# EAGLE design Maker Faire Machine Panel3 (EAGLE 7.5.0)
DATABASE: /home/monkbroc/Electronics/eagle/PARTSDB.tsv
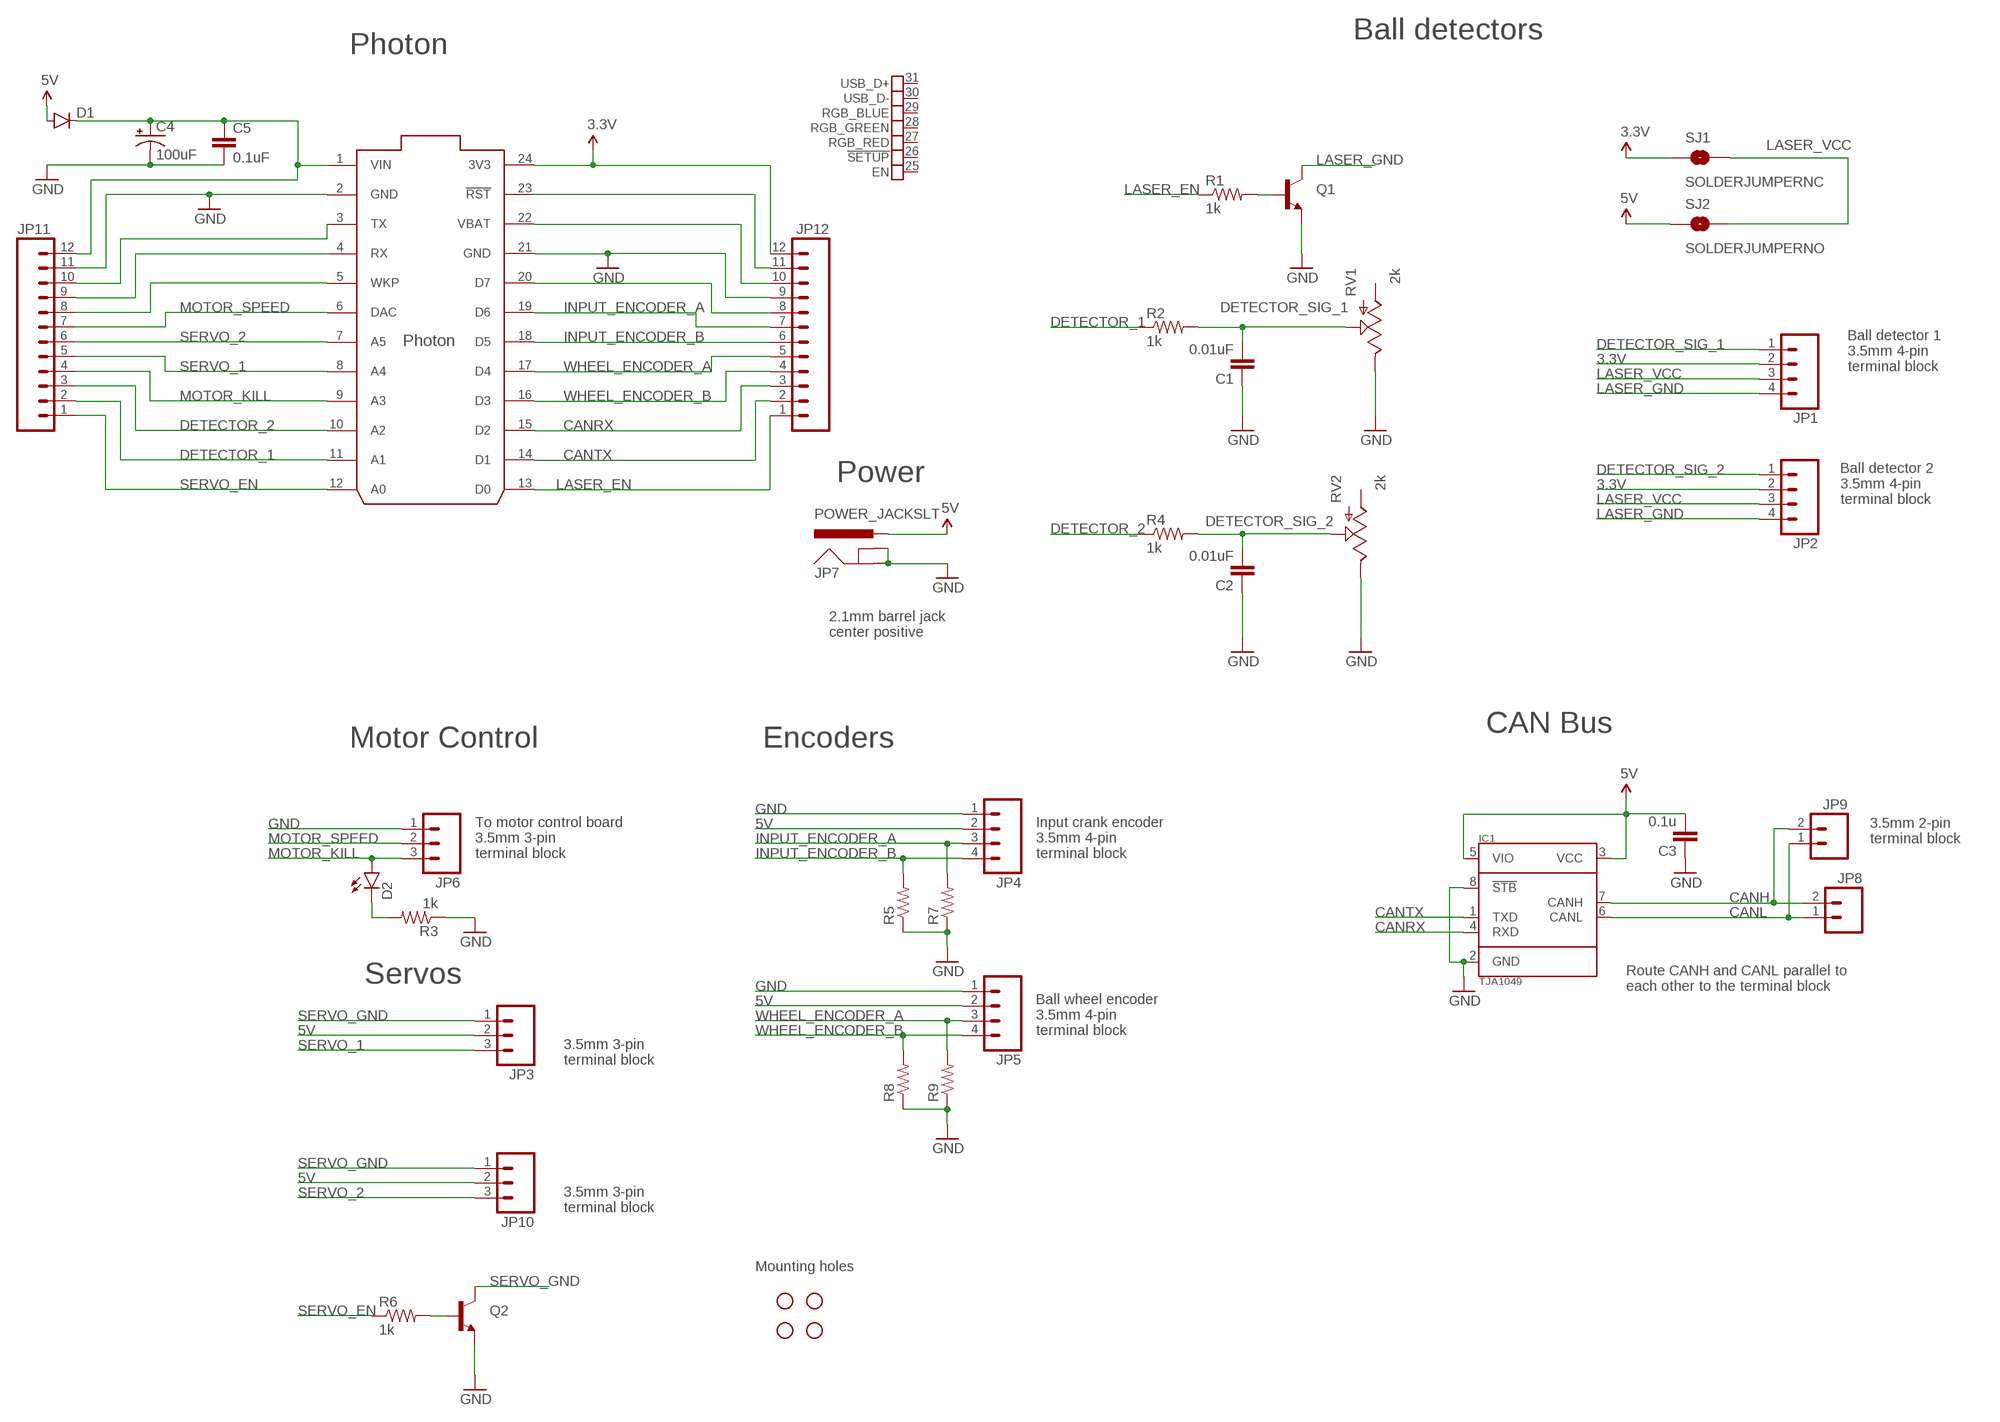
[diagram p0: schematic, sheet 1]

## Parts
C1  0.01uF  CAP1206  [1206]
C2  0.01uF  CAP1206  [1206]
C3  0.1u  CAP1206  [1206]
C4  100uF  CAP_POLPTH1  [CPOL-RADIAL-100UF-25V]
C5  0.1uF  CAP1206  [1206]
D1  DIODESMA  [SMA-DIODE]
D2  LED5MM  [LED5MM]
IC1  TJA1049  [SO8]
JP1  M04SCREW  [SCREWTERMINAL-3.5MM-4]
JP2  M04SCREW  [SCREWTERMINAL-3.5MM-4]
JP3  M03SCREW  [SCREWTERMINAL-3.5MM-3]
JP4  M04SCREW  [SCREWTERMINAL-3.5MM-4]
JP5  M04SCREW  [SCREWTERMINAL-3.5MM-4]
JP6  M03SCREW  [SCREWTERMINAL-3.5MM-3]
JP7  POWER_JACKSLT  [POWER_JACK_SLOT]
JP8  M023.5MM  [SCREWTERMINAL-3.5MM-2]
JP9  M023.5MM  [SCREWTERMINAL-3.5MM-2]
JP10  M03SCREW  [SCREWTERMINAL-3.5MM-3]
JP11  M12NO_SILK  [1X12_NO_SILK]
JP12  M12NO_SILK  [1X12_NO_SILK]
Q1  TRANSISTOR_NPNTO-92-AMMO  [TO-92-AMMO]
Q2  TRANSISTOR_NPNTO-92-AMMO  [TO-92-AMMO]
R1  1k  RESISTOR1206  [1206]
R2  1k  RESISTOR1206  [1206]
R3  1k  RESISTOR1206  [1206]
R4  1k  RESISTOR1206  [1206]
R5  RESISTORKIT  [AXIAL-0.3-KIT]
R6  1k  RESISTOR1206  [1206]
R7  RESISTORKIT  [AXIAL-0.3-KIT]
R8  RESISTORKIT  [AXIAL-0.3-KIT]
R9  RESISTORKIT  [AXIAL-0.3-KIT]
RV1  2k  POT100K_3362U  [3362U]
RV2  2k  POT100K_3362U  [3362U]
SJ1  SOLDERJUMPERNC  [SJ_2S]
SJ2  SOLDERJUMPERNO  [SJ_2S-NO]
STANDOFF1  STAND-OFF  [STAND-OFF]
STANDOFF2  STAND-OFF  [STAND-OFF]
STANDOFF3  STAND-OFF  [STAND-OFF]
STANDOFF4  STAND-OFF  [STAND-OFF]
U$1  PHOTON_SMD  [PHOTON_SMD]

## Nets
3.3V: JP1.2 JP2.2 JP12.12 SJ1.1 U$1.24(3V3)
5V: C3.2 D1.A IC1.3(VCC) IC1.5(VIO) JP3.2 JP4.2 JP5.2 JP7.PWR JP10.2 SJ2.1
CANH: IC1.7(CANH) JP8.2 JP9.2
CANL: IC1.6(CANL) JP8.1 JP9.1
CANRX: IC1.4(RXD) JP12.3 U$1.15(D2)
CANTX: IC1.1(TXD) JP12.2 U$1.14(D1)
DETECTOR_1: JP11.2 R2.1 U$1.11(A1)
DETECTOR_2: JP11.3 R4.1 U$1.10(A2)
DETECTOR_SIG_1: C1.2 JP1.1 R2.2 RV1.P$2(S)
DETECTOR_SIG_2: C2.2 JP2.1 R4.2 RV2.P$2(S)
GND: C1.1 C2.1 C3.1 C4.2(-) C5.2 IC1.2(GND) IC1.8(!STB) JP4.1 JP5.1 JP6.1 JP7.GND@1(GNDBREAK) JP7.GND@2(GND) JP11.11 JP12.9 Q1.1(E) Q2.1(E) R3.1 R5.P$1 R7.P$1 R8.P$1 R9.P$1 RV1.P$1(E) RV2.P$1(E) U$1.2(GND) U$1.21(GND)
INPUT_ENCODER_A: JP4.3 JP12.7 R7.P$2 U$1.19(D6)
INPUT_ENCODER_B: JP4.4 JP12.6 R5.P$2 U$1.18(D5)
LASER_EN: JP12.1 R1.1 U$1.13(D0)
LASER_GND: JP1.4 JP2.4 Q1.3(C)
LASER_VCC: JP1.3 JP2.3 SJ1.2 SJ2.2
MOTOR_KILL: D2.A JP6.3 JP11.4 U$1.9(A3)
MOTOR_SPEED: JP6.2 JP11.7 U$1.6(DAC)
N$1: Q1.2(B) R1.2
N$4: Q2.2(B) R6.2
N$5: D2.K(C) R3.2
N$11: JP12.8 U$1.20(D7)
N$13: JP12.10 U$1.22(VBAT)
N$14: JP12.11 U$1.23(!RST)
RX: JP11.9 U$1.4(RX)
SERVO_1: JP3.3 JP11.5 U$1.8(A4)
SERVO_2: JP10.3 JP11.6 U$1.7(A5)
SERVO_EN: JP11.1 R6.1 U$1.12(A0)
SERVO_GND: JP3.1 JP10.1 Q2.3(C)
TX: JP11.10 U$1.3(TX)
VIN: C4.1(+) C5.1 D1.C JP11.12 U$1.1(VIN)
WHEEL_ENCODER_A: JP5.3 JP12.5 R9.P$2 U$1.17(D4)
WHEEL_ENCODER_B: JP5.4 JP12.4 R8.P$2 U$1.16(D3)
WKP: JP11.8 U$1.5(WKP)
Unconnected: RV1.P$3(A) RV2.P$3(A) U$1.25(EN) U$1.26(!SETUP) U$1.27(RGB_RED) U$1.28(RGB_GREEN) U$1.29(RGB_BLUE) U$1.30(USB_D-) U$1.31(USB_D+)

## Notes on the sheet
- Ball detectors
- Photon
- Ball detector 1
  3.5mm 4-pin
  terminal block
- Power
- Ball detector 2
  3.5mm 4-pin
  terminal block
- 2.1mm barrel jack
  center positive
- CAN Bus
- Motor Control | Encoders
- 3.5mm 2-pin
  terminal block
- To motor control board
  3.5mm 3-pin
  terminal block
- Input crank encoder
  3.5mm 4-pin
  terminal block
- Servos
- Route CANH and CANL parallel to
  each other to the terminal block
- Ball wheel encoder
  3.5mm 4-pin
  terminal block
- 3.5mm 3-pin
  terminal block
- 3.5mm 3-pin
  terminal block
- Mounting holes

## Library data of the parts
C1 C2 = SparkFun-Passives:CAP: Capacitor Standard 0603 ceramic capacitor, and 0.1" leaded capacitor.; PARTNO: 12065C103KAT2A
C3 C5 = SparkFun-Capacitors:CAP: Capacitor Standard 0603 ceramic capacitor, and 0.1" leaded capacitor.; PARTNO: 12065C104KAT2A
C4 = SparkFun-Capacitors:CAP_POL: Capacitor Polarized These are standard SMD and PTH capacitors. Normally 10uF, 47uF, and 100uF in electrolytic and tantalum varieties. Always verify the external diameter of the through hole cap, it varies with capacity, voltage, and manufacturer. The EIA devices should be standard.; PARTNO: EEU-FM1H101B
D1 = SparkFun-DiscreteSemi:DIODE: Diode These are standard reverse protection diodes and small signal diodes. SMA package can handle up to about 1A. SOD-323 can handle about 200mA. What the SOD-323 package when ordering, there are some mfgs out there that are 5-pin packages.; PARTNO: B230A-13-F
D2 = SparkFun-LED:LED: LEDs Standard schematic elements and footprints for 5mm, 3mm, 1206, and 0603 sized LEDs. 5mm - Spark Fun Electronics SKU : COM-00529 (and others); PARTNO: SSL-LX5093HD
IC1 = CAN:TJA1049; PARTNO: TJA1049T-118
JP1 JP2 JP4 = SparkFun-Connectors:M04: Header 4 Standard 4-pin 0.1" header. Use with straight break away headers (SKU : PRT-00116), right angle break away headers (PRT-00553), swiss pins (PRT-00743), machine pins (PRT-00117), and female headers (PRT-00115). Molex polarized connector foot print use with SKU : PRT-08231 with associated crimp pins and housings. 1MM SMD Version SKU: PRT-10208; PARTNO: OSTTE040104
JP3 JP6 = SparkFun-Connectors:M03: Header 3 Standard 3-pin 0.1" header. Use with straight break away headers (SKU : PRT-00116), right angle break away headers (PRT-00553), swiss pins (PRT-00743), machine pins (PRT-00117), and female headers (PRT-00115). Molex polarized connector foot print use with SKU : PRT-08232 with associated crimp pins and housings.; PARTNO: OSTTE020104; PROD_ID: CONN-08288
JP5 = SparkFun-Connectors:M04: Header 4 Standard 4-pin 0.1" header. Use with straight break away headers (SKU : PRT-00116), right angle break away headers (PRT-00553), swiss pins (PRT-00743), machine pins (PRT-00117), and female headers (PRT-00115). Molex polarized connector foot print use with SKU : PRT-08231 with associated crimp pins and housings. 1MM SMD Version SKU: PRT-10208; PARTNO: OSTTE030104
JP7 = SparkFun-Connectors:POWER_JACK: Power Jack This is the standard 5.5mm barrel jack for power. The PTH is the most common, proven, reliable, footprint. The Slot footprint only works if the mill layer is transmitted to the PCB fab house so be warned. Mating wall wart : TOL-00298 (and others); PARTNO: PJ-202A; PROD_ID: PRT-00119
JP8 JP9 = SparkFun-Connectors:M02: Standard 2-pin 0.1" header. Use with - straight break away headers ( PRT-00116) - right angle break away headers (PRT-00553) - swiss pins (PRT-00743) - machine pins (PRT-00117) - female headers (PRT-00115) Molex polarized connector foot print use with: PRT-08233 with associated crimp pins and housings. 2.54_SCREWTERM for use with PRT-10571. 3.5mm Screw Terminal footprints for PRT-08084 5mm Screw Terminal footprints for use with PRT-08432; PARTNO: OSTTE020104; PROD_ID: CONN-08399
JP10 = SparkFun-Connectors:M03: Header 3 Standard 3-pin 0.1" header. Use with straight break away headers (SKU : PRT-00116), right angle break away headers (PRT-00553), swiss pins (PRT-00743), machine pins (PRT-00117), and female headers (PRT-00115). Molex polarized connector foot print use with SKU : PRT-08232 with associated crimp pins and housings.; PARTNO: OSTTE030104; PROD_ID: CONN-08288
JP11 JP12 = SparkFun-Connectors:M12: Header 12 Standard 12-pin 0.1" header. Use with straight break away headers (SKU : PRT-00116), right angle break away headers (PRT-00553), swiss pins (PRT-00743), machine pins (PRT-00117), and female headers (PRT-00115).; BOM: EXCLUDE
Q1 Q2 = SparkFun-DiscreteSemi:TRANSISTOR_NPN: Generic NPN BJT MMBT2222A - TRANS-08049 (SOT-23, 1A 40V) MPSA42 - TRANS-09116 (SOT-23, 500mA 300V) MMBT5088LT1G - TRANS-11160 (SOT-23, 50 mA 30V) BC547 - COM-08928 <http://www.sparkfun.com/products/8928> (TO-92 45V 100mA) (1.Collector 2.Base 3.Emitter) 2N3904 - COM-00521 <http://www.sparkfun.com/products/521> (TO-92 40V 200mA) (1.Emitter 2.Base 3.Collector) P2N2222A - COM-12852 <http://www.sparkfun.com/products/12852> (TO-92 40V 600mA) (1.Collector 2.Base 3.Emitter); PARTNO: PN2222ABU
R1-R4 R6 = SparkFun-Passives:RESISTOR: Resistor Basic schematic elements and footprints for 0603, 1206, and PTH resistors.; PARTNO: ERJ-8ENF1001V
R5 R7-R9 = SparkFun-Resistors:RESISTOR: Resistor Basic schematic elements and footprints for 0603, 1206, and PTH resistors.; BOM: EXCLUDE
RV1 RV2 = SparkFun-Electromechanical:POT; PARTNO: 3362U-1-202LF
SJ1 SJ2 = SparkFun-Retired:SOLDERJUMPER: Solder Jumper Standard SMD solder jumper. Used to automate production. Two varients : Normally Open and Normally Closed are the same, but have different paste layers. NC will have a large amount of paste and should jumper during reflow.; BOM: EXCLUDE
STANDOFF1-STANDOFF4 = SparkFun-Electromechanical:STAND-OFF: #4 Stand Off This is the mechanical footprint for a #4 phillips button head screw. Use the keepout ring to avoid running the screw head into surrounding components. SKU : PRT-00447; BOM: EXCLUDE
U$1 = Particle-Devices:PHOTON_SMD: Particle Photon surface mount

## Board
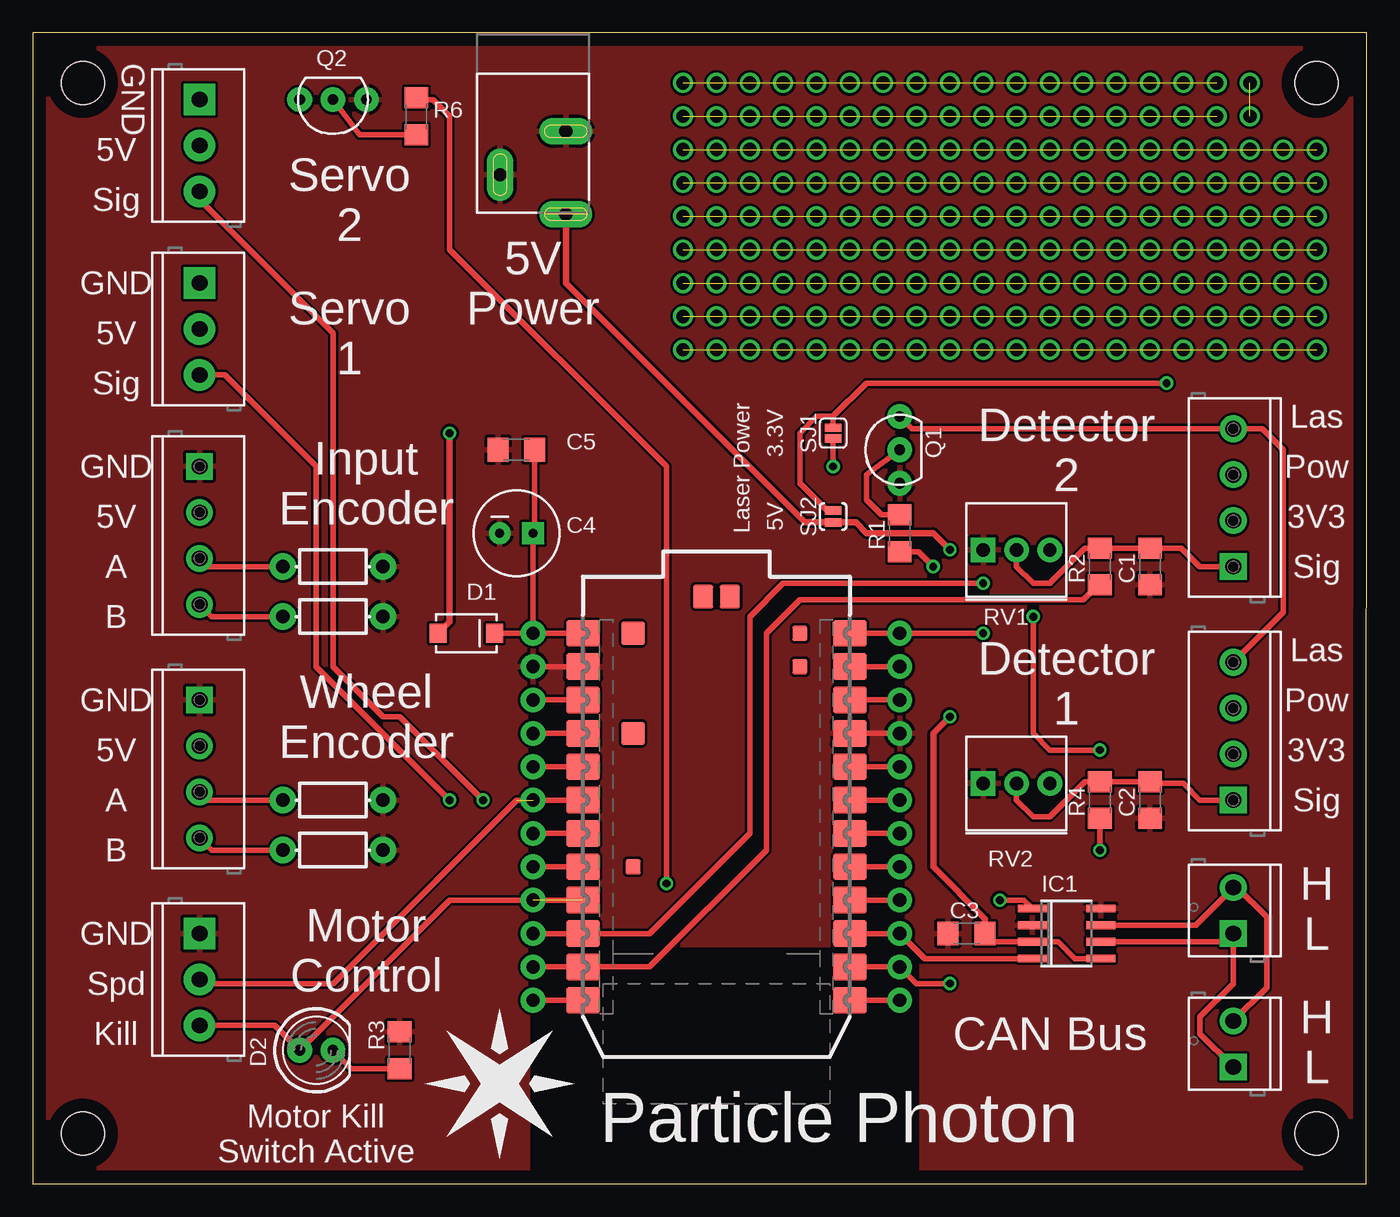
[diagram p1: board, top side]
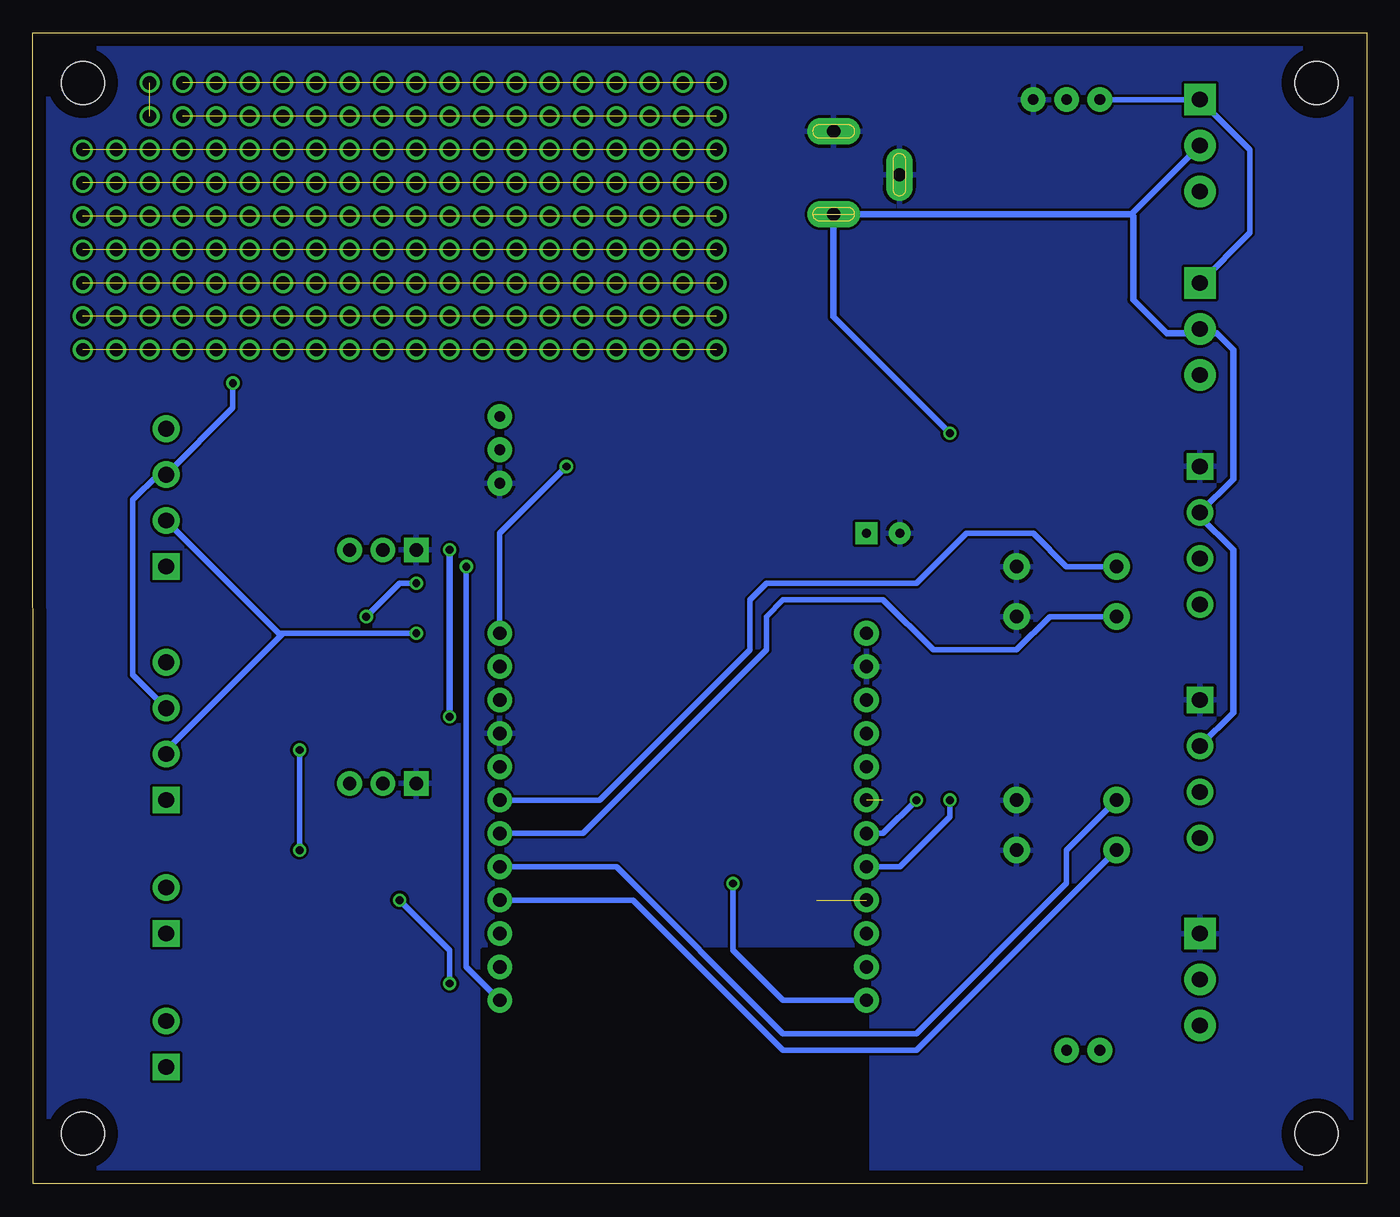
[diagram p2: board, bottom side, seen from below]

Size 101.6 x 87.63 mm. Coordinates in mm from the lower left corner, seen from the top.
Outline: 0,0 101.58,0 101.6,87.63 0,87.63 0,0
Copper layers (1*16): Top 0.035mm / dielectric 1.5mm / Bottom 0.035mm
Design rules "default": minimum track width 10mil, minimum drill 0.6mm, track to track 8mil, track to pad 8mil, pad to pad 8mil, via to via 8mil, smd to smd 8mil, copper to edge 40mil, drill to drill 8mil, minimum pad ring 10mil, minimum via ring 8mil, stop-mask expansion 4mil, vias tented up to drill 0mil, thermal gap 10mil
tRestrict: area 38.1,0 to 67.3,17.8
bRestrict: area 38.1,0 to 67.3,17.8

### Footprints (pad centres in the part's own frame; a part is rotated, then mirrored left to right if it is on the bottom)
1206 = smd 1.6 x 1.8: 1 -1.4,0; 2 1.4,0
CPOL-RADIAL-100UF-25V = drill 0.7 pad 1.651 square: 1 1.27,0 | drill 0.7 pad 1.651: 2 -1.27,0
SMA-DIODE = smd 1.27 x 1.47: A -2.15,0; C 2.15,0
LED5MM = drill 0.813 pad 1.88: A -1.27,0; K 1.27,0
SO8 = smd 0.6 x 2.2: 1 -1.905,-2.6; 2 -0.635,-2.6; 3 0.635,-2.6; 4 1.905,-2.6; 5 1.905,2.6; 6 0.635,2.6; 7 -0.635,2.6; 8 -1.905,2.6
SCREWTERMINAL-3.5MM-4 = drill 1.2 pad 2.032 square: 1 0,0 | drill 1.2 pad 2.032: 2 3.5,0; 3 7,0; 4 10.5,0
SCREWTERMINAL-3.5MM-3 = drill 1.2 pad 2.413 square: 1 0,0 | drill 1.2 pad 2.413: 2 3.5,0; 3 7,0
POWER_JACK_SLOT = drill 1 pad 2 long: GND@1 2.58,7.5; GND@2 7.58,10.8; PWR 2.58,13.8
SCREWTERMINAL-3.5MM-2 = drill 1.2 pad 2.032 square: 1 0,0 | drill 1.2 pad 2.032: 2 3.5,0
1X12_NO_SILK = drill 1.016 pad 1.88: 1 0,0; 2 2.54,0; 3 5.08,0; 4 7.62,0; 5 10.16,0; 6 12.7,0; 7 15.24,0; 8 17.78,0; 9 20.32,0; 10 22.86,0; 11 25.4,0; 12 27.94,0
TO-92-AMMO = drill 0.813 pad 1.88: 1 -2.54,0; 2 0,0; 3 2.54,0
AXIAL-0.3-KIT = drill 1.016 pad 2.032: P$1 -3.81,0; P$2 3.81,0
3362U = drill 1.016 pad 1.88 square: P$1 0,2.54 | drill 1.016 pad 1.88: P$2 2.54,2.54; P$3 5.08,2.54
SJ_2S = smd 0.635 x 1.27: 1 -0.412,0; 2 0.412,0
SJ_2S-NO = smd 0.635 x 1.27: 1 -0.45,0; 2 0.45,0
STAND-OFF = hole 3.302: 0,0
PHOTON_SMD = smd 2.54 x 2.032: 1 0,33.02; 2 0,30.48; 3 0,27.94; 4 0,25.4; 5 0,22.86; 6 0,20.32; 7 0,17.78; 8 0,15.24; 9 0,12.7; 10 0,10.16; 11 0,7.62; 12 0,5.08; 13 20.32,5.08; 14 20.32,7.62; 15 20.32,10.16; 16 20.32,12.7; 17 20.32,15.24; 18 20.32,17.78; 19 20.32,20.32; 20 20.32,22.86; 21 20.32,25.4; 22 20.32,27.94; 23 20.32,30.48; 24 20.32,33.02 | smd 1.778 x 1.778: 25 3.81,33.02; 26 3.81,25.4 | smd 1.143 x 1.143: 27 3.81,15.24; 28 16.51,30.48; 29 16.51,33.02 | smd 1.524 x 1.778: 30 11.176,35.814; 31 9.144,35.814

### Placement (x,y rotation side)
C1  85.09,46.99 90 top
C2  85.09,29.21 90 top
C3  71.12,19.05 0 top
C4  36.83,49.53 0 top
C5  36.83,55.88 180 top
D1  33.02,41.91 0 top
D2  21.59,10.16 0 top
IC1  78.74,19.05 270 top
JP1  91.44,46.99 90 top
JP2  91.44,29.21 90 top
JP3  12.7,68.58 270 top
JP4  12.7,54.61 270 top
JP5  12.7,36.83 270 top
JP6  12.7,19.05 270 top
JP7  43.18,87.63 180 top
JP8  91.44,19.05 90 top
JP9  91.44,8.89 90 top
JP10  12.7,82.55 270 top
JP11  38.1,13.97 90 top
JP12  66.04,13.97 90 top
Q1  66.04,55.88 90 top
Q2  22.86,82.55 180 top
R1  66.04,49.53 90 top
R2  81.28,46.99 90 top
R3  27.94,10.16 270 top
R4  81.28,29.21 90 top
R5  22.86,43.18 180 top
R6  29.21,81.28 270 top
R7  22.86,46.99 180 top
R8  22.86,25.4 180 top
R9  22.86,29.21 180 top
RV1  72.39,45.72 0 top
RV2  72.39,27.94 0 top
SJ1  60.96,57.15 90 top
SJ2  60.96,50.8 90 top
STANDOFF1  3.81,83.82 0 top
STANDOFF2  3.81,3.81 0 top
STANDOFF3  97.79,3.81 0 top
STANDOFF4  97.79,83.82 0 top
U$1  41.91,8.89 0 top

### Tracks (layer width: path | path; a pad name or v marks a point on that pad's centre or on a via)
3.3V  (via drill 0.6)
  Top 0.406: v72.39,41.91 JP12.12 U$1.24 | v60.96,54.61 SJ1.1
  Bottom 0.406: 82.55,41.91 82.86,41.91 JP1.2 | JP2.2 91.44,33.02 82.55,41.91 | v72.39,41.91 82.55,41.91 | JP12.12 66.04,49.53 v60.96,54.61
  other vias: 66.04,41.91
5V  (via drill 0.6)
  Top 0.406: C3.2 73.16,18.41 IC1.3 78.11,18.41 79.38,17.14 IC1.5
  Top 0.508: v31.75,57.15 31.75,42.79 D1.A | JP7.PWR 40.6,68.58 58.83,50.35 SJ2.1 62.68,50.35 63.5,49.53 68.58,49.53 v69.85,48.26 | C3.2 72.52,20.19 68.58,24.13 68.58,34.29 v69.85,35.56
  Bottom 0.508: JP7.PWR 17.92,73.83 JP10.2 | JP7.PWR 17.95,73.83 17.78,73.66 17.78,67.31 15.24,64.77 13.01,64.77 | 13.01,64.77 JP3.2 | JP7.PWR 40.6,66 v31.75,57.15 | 13.01,64.77 11.43,64.77 10.16,63.5 10.16,53.65 JP4.2 12.7,50.8 10.16,48.26 10.16,35.87 JP5.2 | v69.85,35.56 v69.85,48.26
CANH
  Top 0.406: JP9.2 93.98,14.93 93.98,20.32 91.75,22.55 JP8.2 88.58,19.68 IC1.7
CANL
  Top 0.406: JP9.1 88.9,11.43 88.9,12.7 91.44,15.24 JP8.1 90.81,18.41 IC1.6
CANRX
  Top 0.406: U$1.15 JP12.3 67.95,17.14 IC1.4
CANTX  (via drill 0.6)
  Top 0.406: U$1.14 JP12.2 67.31,15.24 v69.85,15.24 | v73.66,21.59 75.51,21.59 IC1.1
  Bottom 0.406: v69.85,15.24 69.85,17.78 v73.66,21.59
DETECTOR_1
  Top 0.406: JP11.2 U$1.11 46.99,16.51 55.88,25.4 55.88,41.91 58.42,44.45 80.01,44.45 81.28,45.72 R2.1
DETECTOR_2  (via drill 0.6)
  Top 0.406: JP11.3 U$1.10 46.99,19.05 54.61,26.67 54.61,43.18 57.15,45.72 v72.39,45.72 | v76.2,43.18 76.2,34.29 77.47,33.02 v81.28,33.02 | v81.28,25.4 R4.1
  Bottom 0.406: v72.39,45.72 73.66,45.72 v76.2,43.18 | v81.28,33.02 v81.28,25.4
DETECTOR_SIG_1
  Top 0.406: JP1.1 88.9,46.99 87.5,48.39 C1.2 R2.2 80.14,48.39 77.47,45.72 76.2,45.72 74.93,46.99 RV1.P$2
DETECTOR_SIG_2
  Top 0.406: JP2.1 88.9,29.21 87.63,30.48 85.22,30.48 C2.2 R4.2 80.14,30.61 77.47,27.94 76.2,27.94 74.93,29.21 RV2.P$2
GND
  Top 0.406: U$1.21 JP12.9 | JP11.11 U$1.2
  pour Top: 0,87.63 101.6,87.63 101.6,0 0,0
  pour Bottom: 0,87.63 101.6,87.63 101.6,0 0,0
INPUT_ENCODER_A
  Top 0.406: R7.P$2 13.32,46.99 JP4.3 | JP12.7 U$1.19
  Bottom 0.406: R7.P$2 22.86,46.99 25.4,49.53 30.48,49.53 34.29,45.72 45.72,45.72 46.99,44.45 46.99,40.64 58.42,29.21 JP12.7
INPUT_ENCODER_B  (via drill 0.6)
  Top 0.406: R5.P$2 13.63,43.18 JP4.4 | U$1.18 JP12.6
  Bottom 0.406: R5.P$2 24.13,43.18 26.67,40.64 33.02,40.64 36.83,44.45 44.45,44.45 45.72,43.18 45.72,40.64 59.69,26.67 JP12.6
  other vias: 66.04,26.67
LASER_EN  (via drill 0.6)
  Top 0.406: U$1.13 JP12.1 | R1.1 67.44,48.13 v68.58,46.99
  Bottom 0.406: v68.58,46.99 68.58,16.51 JP12.1
LASER_GND
  Top 0.406: JP2.4 95.25,43.52 95.25,55.88 93.64,57.49 JP1.4 66.97,57.49 Q1.3
LASER_VCC  (via drill 0.6)
  Top 0.406: SJ2.2 60.51,51.25 58.42,53.34 58.42,57.15 59.69,58.42 60.96,58.42 | SJ1.2 60.96,58.42 | 60.96,58.42 63.5,60.96 v86.36,60.96
  Bottom 0.406: v86.36,60.96 86.36,59.07 JP1.3 92.06,53.99 93.98,52.07 93.98,38.75 JP2.3
MOTOR_KILL  (1 unrouted)
  Top 0.406: U$1.9 31.75,21.59 D2.A 18.43,12.05 JP6.3
MOTOR_SPEED  (1 unrouted)
  Top 0.406: JP6.2 13.01,15.24 22.86,15.24 36.83,29.21 U$1.6
N$1
  Top 0.406: R1.2 64.64,50.93 63.5,52.07 63.5,53.98 Q1.2
N$2  (via drill 1.02)  (19 unrouted)
  other vias: 92.71,63.5 90.17,63.5 87.63,63.5 85.09,63.5 82.55,63.5 80.01,63.5 77.47,63.5 74.93,63.5 72.39,63.5 69.85,63.5 64.77,63.5 67.31,63.5 62.23,63.5 59.69,63.5 57.15,63.5 54.61,63.5 52.07,63.5 95.25,63.5 97.79,63.5 49.53,63.5
N$4
  Top 0.406: R6.2 24.89,79.88 Q2.2
N$5
  Top 0.406: R3.2 24.26,8.76 D2.K
N$6  (via drill 1.02)  (19 unrouted)
  other vias: 92.71,66.04 90.17,66.04 87.63,66.04 85.09,66.04 82.55,66.04 80.01,66.04 77.47,66.04 74.93,66.04 72.39,66.04 69.85,66.04 64.77,66.04 67.31,66.04 62.23,66.04 59.69,66.04 57.15,66.04 54.61,66.04 52.07,66.04 95.25,66.04 97.79,66.04 49.53,66.04
N$7  (via drill 1.02)  (19 unrouted)
  other vias: 92.71,68.58 90.17,68.58 87.63,68.58 85.09,68.58 82.55,68.58 80.01,68.58 77.47,68.58 74.93,68.58 72.39,68.58 69.85,68.58 64.77,68.58 67.31,68.58 62.23,68.58 59.69,68.58 57.15,68.58 54.61,68.58 52.07,68.58 95.25,68.58 97.79,68.58 49.53,68.58
N$8  (via drill 1.02)  (19 unrouted)
  other vias: 92.71,71.12 90.17,71.12 87.63,71.12 85.09,71.12 82.55,71.12 80.01,71.12 77.47,71.12 74.93,71.12 72.39,71.12 69.85,71.12 64.77,71.12 67.31,71.12 62.23,71.12 59.69,71.12 57.15,71.12 54.61,71.12 52.07,71.12 95.25,71.12 97.79,71.12 49.53,71.12
N$9  (via drill 1.02)  (19 unrouted)
  other vias: 92.71,73.66 90.17,73.66 87.63,73.66 85.09,73.66 82.55,73.66 80.01,73.66 77.47,73.66 74.93,73.66 72.39,73.66 69.85,73.66 64.77,73.66 67.31,73.66 62.23,73.66 59.69,73.66 57.15,73.66 54.61,73.66 52.07,73.66 95.25,73.66 97.79,73.66 49.53,73.66
N$10  (via drill 1.02)  (19 unrouted)
  other vias: 92.71,76.2 90.17,76.2 87.63,76.2 85.09,76.2 82.55,76.2 80.01,76.2 77.47,76.2 74.93,76.2 72.39,76.2 69.85,76.2 64.77,76.2 67.31,76.2 62.23,76.2 59.69,76.2 57.15,76.2 54.61,76.2 52.07,76.2 95.25,76.2 97.79,76.2 49.53,76.2
N$11
  Top 0.406: U$1.20 JP12.8
N$12  (via drill 1.02)  (19 unrouted)
  other vias: 92.71,78.74 90.17,78.74 87.63,78.74 85.09,78.74 82.55,78.74 80.01,78.74 77.47,78.74 74.93,78.74 72.39,78.74 69.85,78.74 64.77,78.74 67.31,78.74 62.23,78.74 59.69,78.74 57.15,78.74 54.61,78.74 52.07,78.74 95.25,78.74 97.79,78.74 49.53,78.74
N$13
  Top 0.406: U$1.22 JP12.10
N$14
  Top 0.406: U$1.23 JP12.11
N$15  (via drill 1.02)  (16 unrouted)
  other vias: 90.17,81.28 87.63,81.28 85.09,81.28 82.55,81.28 80.01,81.28 77.47,81.28 74.93,81.28 72.39,81.28 69.85,81.28 64.77,81.28 67.31,81.28 62.23,81.28 59.69,81.28 57.15,81.28 54.61,81.28 52.07,81.28 49.53,81.28
N$16  (via drill 1.02)  (16 unrouted)
  other vias: 90.17,83.82 87.63,83.82 85.09,83.82 82.55,83.82 80.01,83.82 77.47,83.82 74.93,83.82 72.39,83.82 69.85,83.82 64.77,83.82 67.31,83.82 62.23,83.82 59.69,83.82 57.15,83.82 54.61,83.82 52.07,83.82 49.53,83.82
N$17  (via drill 1.02)  (1 unrouted)
  other vias: 92.71,83.82 92.71,81.28
RX
  Top 0.406: JP11.9 U$1.4
SERVO_1  (via drill 0.6)
  Top 0.406: JP11.5 U$1.8 | JP3.3 14.62,61.58 21.59,54.61 21.59,39.37 v31.75,29.21
  Bottom 0.406: v31.75,29.21 31.75,27.94 35.56,24.13 JP11.5
SERVO_2  (via drill 0.6)
  Top 0.406: JP11.6 U$1.7 | JP10.3 12.7,74.93 22.86,64.77 22.86,39.37 26.67,35.56 27.94,35.56 v34.29,29.21
  Bottom 0.406: v34.29,29.21 36.83,26.67 JP11.6
SERVO_EN  (via drill 0.6)
  Top 0.406: U$1.12 JP11.1 | v48.26,22.86 48.26,54.61 31.75,71.12 31.75,81.28 30.48,82.55 29.34,82.55 R6.1
  Bottom 0.406: v48.26,22.86 48.26,17.78 44.45,13.97 JP11.1
SERVO_GND
  Bottom 0.406: JP3.1 8.89,72.39 8.89,78.74 JP10.1 Q2.3
TX
  Top 0.406: JP11.10 U$1.3
VIN
  Top 0.406: U$1.1 JP11.12 | JP11.12 D1.C | JP11.12 C4.1 38.06,49.57 38.23,49.74 C5.1
WHEEL_ENCODER_A
  Top 0.406: R9.P$2 13.32,29.21 JP5.3 | JP12.5 U$1.17
  Bottom 0.406: R9.P$2 22.86,25.4 22.86,22.86 34.29,11.43 44.45,11.43 57.15,24.13 JP12.5
WHEEL_ENCODER_B
  Top 0.406: R8.P$2 13.63,25.4 JP5.4 | JP12.4 U$1.16
  Bottom 0.406: R8.P$2 34.29,10.16 44.45,10.16 55.88,21.59 JP12.4
WKP
  Top 0.406: JP11.8 U$1.5

### Text on the board
tPlace: GND | 5V | Sig | Servo / 2 | GND | 5V / Power | 5V | Servo / 1 | Sig | Las | 3.3V | Detector / 2 | GND | Pow | Input / Encoder | 5V | 5V | 3V3 | Laser Power | A | Sig | B | Las | Detector / 1 | GND | Pow | Wheel / Encoder | 5V | 3V3 | A | Sig | B | H | GND | L | Motor / Control | Spd | H | Kill | CAN Bus | L | Particle Photon | Motor Kill / Switch Active